# Altium schematic sheet [3] - POWER.SchDoc: POWER INPUT
size B; Organization: Altium Limited; Address1: L3, 12a Rodborough Rd; Address2: Frenchs Forest; Address3: NSW; Address4: Australia 2086; DocumentNumber: 3; Revision: V1I1; SheetNumber: 3; SheetTotal: 16
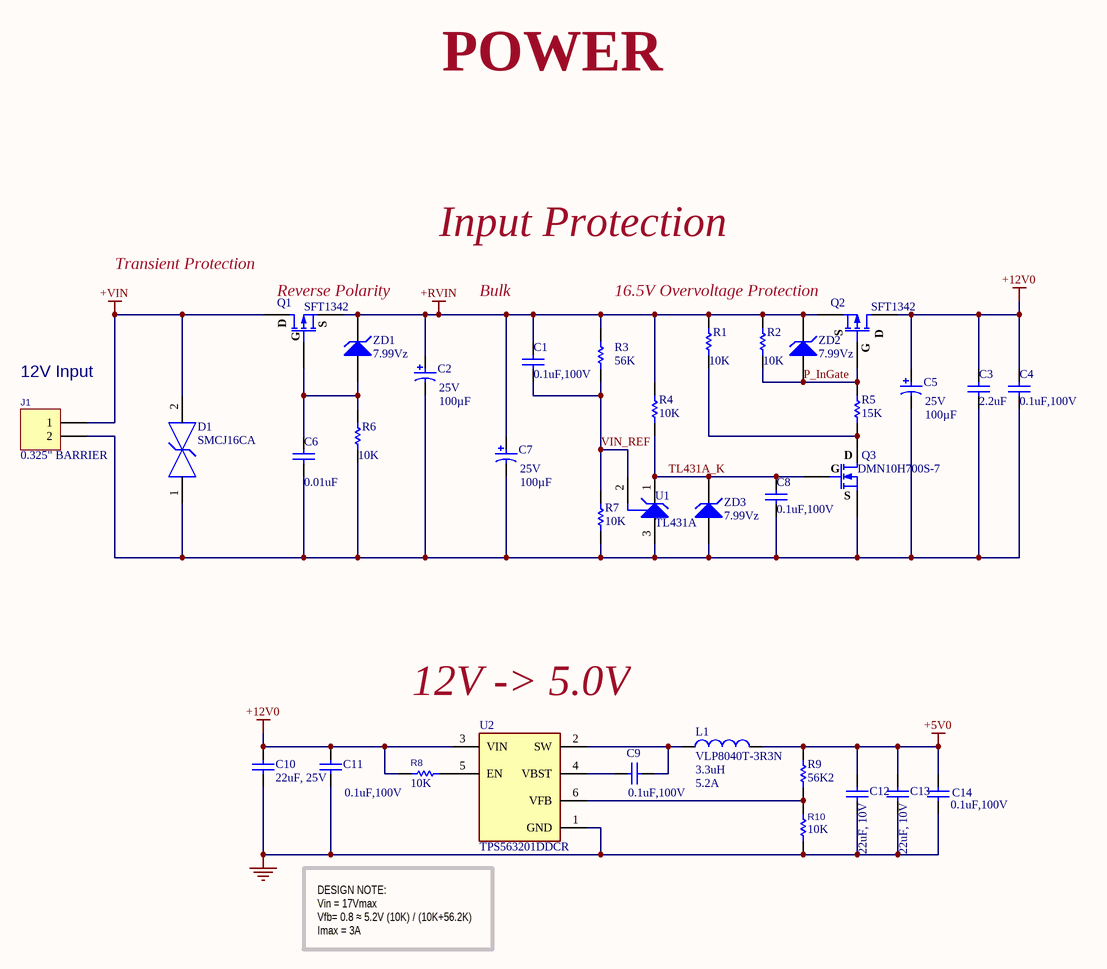
[diagram p0: [3] - POWER.SchDoc]

## Parts
C1  0.1uF,100V  [C0805]
C2  Capacitance: 100µF  Rated Voltage: 25V  [PNSC-FK-V-D8_V]  (hidden comment: EEEFK1E101XP)
C3  2.2uF  [C1206]
C4  0.1uF,100V  [C0805]
C5  Capacitance: 100µF  Rated Voltage: 25V  [PNSC-FK-V-D8_V]  (hidden comment: EEEFK1E101XP)
C6  0.01uF  [C0603]
C7  Capacitance: 100µF  Rated Voltage: 25V  [PNSC-FK-V-D8_V]  (hidden comment: EEEFK1E101XP)
C8  0.1uF,100V  [C0805]
C9  0.1uF,100V  [C0805]
C10  22uF, 25V  [C1210]
C11  0.1uF,100V  [C0805]
C12  22uF, 10V  [C0805]
C13  22uF, 10V  [C0805]
C14  0.1uF,100V  [C0805]
D1  SMCJ16CA  [FP-SMBJ-MFG]
J1  0.325" BARRIER  [Barrier2]
L1  VLP8040T-3R3N  Inductance: 3.3uH  RMS Current (Irms): 5.2A
Q1  SFT1342
Q2  SFT1342
Q3  DMN10H700S-7  [SOT90P240X110-3N]
R1  10K  [R0603]
R2  10K  [R0603]
R3  value 56K  [RESC1608X55X30ML15T15]  (hidden comment: ERJ3EKF5602V)
R4  10K  [R0603]
R5  15K  [R0603]
R6  10K  [R0603]
R7  10K  [R0603]
R8  10K  [R0402]
R9  56K2  [r0402]
R10  10K  [R0402]
U1  TL431A  [TL431AQDBZRQ1]
U2  TPS563201DDCR
ZD1  7.99Vz
ZD2  7.99Vz
ZD3  7.99Vz

## Nets
+5V0: C12.2 C13.2 C14.1 L1.2 R9.2
+12V0: C3.2 C4.2 C5.1 C10.2 C11.2 Q2.1(D) R8.1 U2.3(VIN)
+RVIN: C1.2 C2.1 C7.1 Q1.3(S) Q2.3(S) R1.2 R2.2 R3.2 R4.2 ZD1.2(K) ZD2.2(K)
+VIN: D1.2 J1.1 Q1.1(D)
GND: C10.1 C11.1 C12.1 C13.1 C14.2 R10.1 U2.1(GND)
P_InGate: Q2.2(G) R2.1 R5.2 ZD2.1(A)
TL431A_K: C8.2 Q3.1(G) R4.1 U1.1(CATHODE) ZD3.2(K)
VIN_REF: C1.1 R3.1 R7.2 U1.2(REF)
NetC2_2: C2.2 C3.1 C4.1 C5.2 C6.1 C7.2 C8.1 D1.1 J1.2 Q3.2(S) R6.1 R7.1 U1.3(ANODE) ZD3.1(A)
NetC6_2: C6.2 Q1.2(G) R6.2 ZD1.1(A)
NetC9_1: C9.1 L1.1 U2.2(SW)
NetC9_2: C9.2 U2.4(VBST)
NetQ3_3: Q3.3(D) R1.1 R5.1
NetR8_2: R8.2 U2.5(EN)
NetR9_1: R9.1 R10.2 U2.6(VFB)

## Notes on the sheet
- POWER
- (near Q1) Transient Protection
- Input Protection
- (near Q1) Reverse Polarity
- Bulk
- (near Q2) 16.5V Overvoltage Protection
- (near J1) 12V Input
- 12V -> 5.0V
- DESIGN NOTE:
  Vin = 17Vmax
  Vfb= 0.8 ≈ 5.2V (10K) / (10K+56.2K)
  Imax = 3A
- Title
- Size:
- Date:
- B
- Number:
- Time:
- Revision:
- Sheet
- of
- Mathew Locoteta
- 85 Artist Lake Dr.
- Middle Island
- New York, 11953
- United States of America
- File:

## Library data of the parts
C1 C4 C8 C9 C11 C14 = CL21B104KCFWPNE: CAP CER 0.1UF 100V X7R 0805; Manufacturer: Samsung; Capacitance: 100nF; Tolerance: 10%; Supplier 1: Digi-Key; Manufacturer Part Number: CL21B104KCFWPNE; Stock 1: 283289; Pricing 1: 1=0.16000, 10=0.11200, 100=0.05250, 500=0.03684, 1000=0.03050 (USD); RoHS: Yes; Mount: Surface Mount; Case/Package: 0805; Case Code (Metric): 2012; Case Code (Imperial): 0805; Min Operating Temperature: -55°C; Max Operating Temperature: 125°C; Packaging: Tape and Reel; Voltage Rating: 100V; Features: Soft Termination; Length: 0.079inch; Width: 0.049inch; Thickness: 0.053inch; Ratings: AEC-Q200; ComponentLink1URL: http://www.samsungsem.com/servlet/FileDownload?type=spec&file=CL21B104KCFWPNE.pdf&src-supplier=Avnet; ComponentLink1Description: http://www.samsungsem.com/servlet/FileDownload?type=spec&file=CL21B104KCFWPNE.pdf&src-supplier=Avnet; ComponentLink2URL: http://www.samsungsem.com/kr/support/product-search/mlcc/CL21B104KCFWPNE.jsp?src-supplier=Digi-Key; ComponentLink2Description: http://www.samsungsem.com/kr/support/product-search/mlcc/CL21B104KCFWPNE.jsp?src-supplier=Digi-Key; Supplier Part Number 1: 1276-6733-1-ND
C2 C5 C7 = CMP-2000-06206-1: Aluminum Electrolytic Capacitor, 100 uF, +/- 20%, 25 V, 2-Pin SMD (Size Code D8), -55 to 105 degC, RoHS, Tape and Reel; Manufacturer: Panasonic; Type: Can; Lifetime@Temperature: 2000Hrs@105°C; Ripple Current: 280mA; Impedance: 0.34O; Case Size/Dimension: Ø6.3x7.7mm; Operating Temp-Max: 105°C; Series: FK; Package URL: http://industrial.panasonic.com/cdbs/www-data/pdf/RDE0000/DME0000COL48.pdf; Mounting Technology: SurfaceMount; Package Description: 2-Pin Electrolytic Aluminum Capacitor, Body 6.6 x 6.6 mm; Datasheet Version: 03/2016; Datasheet URL: http://industrial.panasonic.com/cdbs/www-data/pdf/RDE0000/ABA0000C1181.pdf; Manufacturer URL: http://www.panasonic.com/; Package Reference: FK-V-D8; Operating Temp Range: -55to+105°C
C3 = C1206C225K5RECAUTO: CAP CER 1206 2.2UF 50V X7R 10%; Manufacturer: KEMET; Supplier 1: Digi-Key; Manufacturer Part Number: C1206C225K5RECAUTO; Stock 1: 3800; Pricing 1: 1=0.34000, 10=0.23200, 100=0.13130, 500=0.09268, 1000=0.08110 (USD); RoHS: No; ComponentLink1URL: https://api.kemet.com/component-edge/download/datasheet/C1206C225K5RECAUTO.pdf?src-supplier=Digi-Key; ComponentLink1Description: https://api.kemet.com/component-edge/download/datasheet/C1206C225K5RECAUTO.pdf?src-supplier=Digi-Key; Supplier Part Number 1: 399-17896-1-ND
C6 = C0603C103J5RACAUTO: Cap Ceramic 0.01uF 50V X7R 5% Pad SMD 0603 125C Automotive T/R; Manufacturer: KEMET; Capacitance: 10nF; Supplier 1: Digi-Key; Manufacturer Part Number: C0603C103J5RACAUTO; Stock 1: 20665; Pricing 1: 1=0.13000, 10=0.08900, 100=0.04200, 500=0.02946, 1000=0.02439 (USD); RoHS: Yes; Mount: Surface Mount; Case/Package: 0603; Case Code (Metric): 1608; Case Code (Imperial): 0603; Dielectric Material: Ceramic; Min Operating Temperature: -55°C; Max Operating Temperature: 125°C; Packaging: Tape and Reel; Voltage Rating: 50V; Tolerance: 5%; Voltage Rating (DC): 50V; Dielectric: X7R; Length: 0.063inch; Width: 0.031inch; Thickness: 0.034inch; Ratings: AEC-Q200; ComponentLink1URL: http://www.farnell.com/datasheets/2626787.pdf?src-supplier=Farnell; ComponentLink1Description: http://www.farnell.com/datasheets/2626787.pdf?src-supplier=Farnell; ComponentLink2URL: http://www.farnell.com/datasheets/2749442.pdf?src-supplier=Farnell; ComponentLink2Description: http://www.farnell.com/datasheets/2749442.pdf?src-supplier=Farnell; ComponentLink3URL: https://api.kemet.com/component-edge/download/datasheet/C0603C103J5RACAUTO.pdf?src-supplier=Digi-Key; ComponentLink3Description: https://api.kemet.com/component-edge/download/datasheet/C0603C103J5RACAUTO.pdf?src-supplier=Digi-Key; Supplier Part Number 1: 399-12983-1-ND
C10 = TMK325B7226MMHP: 22µF ±20% 25V Ceramic Capacitor X7R 1210 (3225 Metric) /; Manufacturer: Taiyo Yuden; Supplier 1: Digi-Key; Manufacturer Part Number: TMK325B7226MMHP; RoHS: No; Stock 1: 1378; Pricing 1: 1=0.84000, 10=0.64100, 100=0.45870, 500=0.35514 (USD); Supplier Part Number 1: 587-TMK325B7226MMHPCT-ND
C12 C13 = GRM21BR61A226ME51L: MURATA - GRM21BR61A226ME51L - CAP, MLCC, X5R, 22UF, 10V, 0805; Tolerance: 20%; Supplier 1: Digi-Key; Manufacturer: Murata; Manufacturer Part Number: GRM21BR61A226ME51L; RoHS: Yes; Category: Ceramic Capacitors; Stock 1: 2854415; Pricing 1: 1=0.36000, 10=0.24400, 100=0.13810, 500=0.09746, 1000=0.08529 (USD); Mount: Surface Mount; Case/Package: 0805; Weight: 0.000335oz; Case Code (Imperial): 0805; Case Code (Metric): 2012; Min Operating Temperature: -55°C; Max Operating Temperature: 85°C; Dielectric: X5R; Termination: SMD/SMT; Voltage Rating (DC): 10V; Package Quantity: 3000; Capacitance: 22uF; Packaging: Tape and Reel; Voltage Rating: 10V; Length: 2mm; Height: 1.25mm; Width: 0.049inch; Thickness: 0.055inch; Depth: 1.25mm; Radiation Hardening: No; Lead Free: Lead Free; REACH SVHC: No SVHC; ComponentLink1URL: http://www.farnell.com/datasheets/1955716.pdf?src-supplier=Farnell; ComponentLink1Description: http://www.farnell.com/datasheets/1955716.pdf?src-supplier=Farnell; ComponentLink2URL: http://components.arrow.com/part/dataview/0323_06961245?src-supplier=Arrow+Europe; ComponentLink2Description: http://components.arrow.com/part/dataview/0323_06961245?src-supplier=Arrow+Europe; ComponentLink3URL: http://www.mouser.com/ds/2/281/c02e-2905.pdf?src-supplier=Mouser; ComponentLink3Description: http://www.mouser.com/ds/2/281/c02e-2905.pdf?src-supplier=Mouser; ComponentLink4URL: http://psearch.en.murata.com/capacitor/product/GRM21BR61A226ME51%23.html?src-supplier=Avnet; ComponentLink4Description: http://psearch.en.murata.com/capacitor/product/GRM21BR61A226ME51%23.html?src-supplier=Avnet; ComponentLink5URL: http://www.farnell.com/datasheets/1955716.pdf?src-supplier=Element14; ComponentLink5Description: http://www.farnell.com/datasheets/1955716.pdf?src-supplier=Element14; ComponentLink6URL: http://search.murata.co.jp/Ceramy/image/img/A01X/G101/ENG/GRM21BR61A226ME51-01.pdf?src-supplier=Digi-Key; ComponentLink6Description: http://search.murata.co.jp/Ceramy/image/img/A01X/G101/ENG/GRM21BR61A226ME51-01.pdf?src-supplier=Digi-Key; ComponentLink7URL: http://www.farnell.com/datasheets/1955716.pdf?src-supplier=Newark; ComponentLink7Description: http://www.farnell.com/datasheets/1955716.pdf?src-supplier=Newark; Supplier Part Number 1: 490-10511-6-ND
D1 = CMP-08607-000021-1: TVS DIODE 18V 29.2V DO214AA; Manufacturer Part Number: SMCJ18CA; Manufacturer: Littelfuse Inc; Number Of Channels: 1; Peak Pulse Power: 600W; Max Junction Temp: +150°C; Peak Pulse Current: 20.6A; Direction: Bidirectional; Breakdown Voltage: 20V; RoHS: TRUE; Lead Free: Yes; Category: Diode; Clamping Voltage: 29.2V; Height: 2.61mm; Reverse Standoff Voltage: 18V; Device Class L3: unset; Device Class L2: TVS Diodes; Package: SMBJ; Digikey Description: TVS DIODE 18V 29.2V DO214AA; Device Class L1: Circuit Protection; ComponentLink2Description: Datasheet; ComponentLink2URL: https://www.littelfuse.com/~/media/electronics/datasheets/tvs_diodes/littelfuse_tvs_diode_smbj_datasheet.pdf.pdf; Temperature: -65°C to +150°C; Temperature Range High: +150°C; Mouser Description: SMBJ Series 29.2 V 0.6 kW Surface Mount Bi-Directional TVS Diode - DO-214AA; Automotive: No; Octopart: https://octopart.com/smbj18ca-littelfuse-350695; Temperature Range Low: -65°C
J1 = OSTYK42102030: CONN BARRIER STRIP 2CIRC 0.325"; Manufacturer: On-Shore Technology; Current Rating: 20A; Voltage Rating: 300V; Number of Circuits: 2; Wire Gauge (Max): 22AWG; Wire Gauge (Min): 12AWG; Pitch: 0.325inch; Supplier 1: Digi-Key; Manufacturer Part Number: OSTYK42102030; Stock 1: 3686; Pricing 1: 1=0.83000, 10=0.51800, 25=0.44320, 50=0.39840, 100=0.39010, 250=0.33200, 500=0.31540, 1000=0.28220, 5000=0.22078 (USD); RoHS: Yes; Mount: Through Hole; Color: Black; Insulation Material: Nylon; Min Operating Temperature: -40°C; Max Operating Temperature: 105°C; Number of Rows: 1; Packaging: Bulk; Number of Wire Entries: 2; Flammability Rating: UL94 V-0; ComponentLink1URL: https://datasheet.ciiva.com/778/ostyk421xx030-778467.pdf?src-supplier=Digi-Key; ComponentLink1Description: https://datasheet.ciiva.com/778/ostyk421xx030-778467.pdf?src-supplier=Digi-Key; Supplier Part Number 1: ED2945-ND
L1 = VLP8040T-3R3N: FIXED IND 3.3UH 5.2A 20 MOHM SMD; Manufacturer: TDK; Core Material: Ferrite; DC Resistance (DCR): 20mR; Test Frequency: 100kHz; Tolerance: 30%; Shielding: Shielded; Supplier 1: Digi-Key; Manufacturer Part Number: VLP8040T-3R3N; RoHS: Yes; Category: Fixed Inductors; Stock 1: 95; Pricing 1: 1=0.60000, 10=0.52700 (USD); Mount: Surface Mount; Case/Package: Nonstandard; Min Operating Temperature: -40°C; Max Operating Temperature: 105°C; Max DC Current: 5.2A; Termination: SMD/SMT; Composition: Wirewound; Military Standard: Not; Package Quantity: 1; Packaging: Tape and Reel; Inductance Tolerance: 30%; Current Rating: 5.2A; Saturation Current: 5.2A; Length: 0.315inch; Height: 4mm; Height - Seated (Max): 0.157inch; Depth: 8.7mm; Width: 8mm; Lead Free: Lead Free; REACH SVHC: No SVHC; ComponentLink1URL: https://datasheet.ciiva.com/4963/e531-vlp-7911-4963552.pdf?src-supplier=Mouser; ComponentLink1Description: https://datasheet.ciiva.com/4963/e531-vlp-7911-4963552.pdf?src-supplier=Mouser; Supplier Part Number 1: 445-6581-1-ND
Q1 Q2 = SFT1342-TL-W: MOSFET P-CH 60V 12A TP-FA; Manufacturer: ON Semiconductor; Rds On Max: 62mR; Input Capacitance: 1.15nF; Max Power Dissipation: 1W; Turn-On Delay Time: 10ns; Rise Time: 37ns; Turn-Off Delay Time: 135ns; Fall Time: 75ns; Gate to Source Voltage (Vgs): 20V; Number of Channels: 1; Drain to Source Breakdown Voltage: -60V; Drain to Source Resistance: 47mR; Reverse Standoff Voltage: 48V; Min Breakdown Voltage: 53.3V; Clamping Voltage: 76V; Power Line Protection: No; Peak Pulse Current: 48A; Supplier 1: Digi-Key; Manufacturer Part Number: SFT1342-TL-W; Stock 1: 758; Pricing 1: 1=0.92000, 10=0.82100, 100=0.64030 (USD); RoHS: Yes; Mount: Surface Mount; Case/Package: TO-252-3; Number of Pins: 4; Weight: 0.139332oz; Min Operating Temperature: -55°C; Max Operating Temperature: 150°C; Package Quantity: 700; Packaging: Tape and Reel; Drain to Source Voltage (Vdss): 60V; Continuous Drain Current (ID): 12A; Length: 7mm; Height: 2.3mm; Width: 6.5mm; Lead Free: Lead Free; ComponentLink1URL: https://datasheet.ciiva.com/46629/sft1342-d-46629559.pdf?src-supplier=Digi-Key; ComponentLink1Description: https://datasheet.ciiva.com/46629/sft1342-d-46629559.pdf?src-supplier=Digi-Key; Supplier Part Number 1: SFT1342-TL-WOSCT-ND; Number of Unidirectional Channels: 1; Composition: Zener; ComponentLink2URL: http://www.mouser.com/ds/2/389/ldp01-26ay-954974.pdf?src-supplier=Mouser; ComponentLink2Description: http://www.mouser.com/ds/2/389/ldp01-26ay-954974.pdf?src-supplier=Mouser; ComponentLink3URL: http://www.st.com/content/ccc/resource/technical/document/datasheet/67/34/b5/f8/23/2c/46/6e/DM00122355.pdf/files/DM00122355.pdf/jcr:content/translations/en.DM00122355.pdf?src-supplier=Digi-Key; ComponentLink3Description: http://www.st.com/content/ccc/resource/technical/document/datasheet/67/34/b5/f8/23/2c/46/6e/DM00122355.pdf/files/DM00122355.pdf/jcr:content/translations/en.DM00122355.pdf?src-supplier=Digi-Key
Q3 = DMN10H700S-7: MOSFET N-CHA 100V 700MA SOT23; Manufacturer: Diodes; Rds On Max: 700mR; Input Capacitance: 235pF; Max Power Dissipation: 400mW; Supplier 1: Digi-Key; Manufacturer Part Number: DMN10H700S-7; Stock 1: 12863; Pricing 1: 1=0.41000, 10=0.30800, 100=0.17450, 500=0.11556, 1000=0.08860 (USD); RoHS: Yes; Mount: Surface Mount; Case/Package: TO-236-3; Min Operating Temperature: -55°C; Max Operating Temperature: 150°C; Packaging: Tape and Reel; Drain to Source Voltage (Vdss): 100V; Continuous Drain Current (ID): 700mA; ComponentLink1URL: https://www.diodes.com/assets/Datasheets/DMN10H700S.pdf?src-supplier=Digi-Key; ComponentLink1Description: https://www.diodes.com/assets/Datasheets/DMN10H700S.pdf?src-supplier=Digi-Key; Supplier Part Number 1: DMN10H700S-7DICT-ND
R1 R2 R4 R6 R7 = RMCF0603FT10K0: RES 10K OHM 1% 1/10W 0603; Manufacturer: Stackpole Electronics; Resistance: 10kR; Power Rating: 100mW; Temperature Coefficient: 100ppm/°C; Supplier 1: Digi-Key; Manufacturer Part Number: RMCF0603FT10K0; Stock 1: 2968232; Pricing 1: 1=0.10000, 10=0.01700, 100=0.00680, 1000=0.00306, 2500=0.00266 (USD); RoHS: Yes; Mount: Surface Mount; Case/Package: 0603; Case Code (Metric): 1608; Case Code (Imperial): 0603; Contact Plating: Tin,Matte; Min Operating Temperature: -55°C; Max Operating Temperature: 155°C; Tolerance: 1%; Packaging: Tape and Reel; Composition: Thick Film; Number of Terminations: 2; Military Standard: Not; Max Power Dissipation: 100mW; Features: Automotive AEC-Q200; Length: 1.55mm; Height: 0.022inch; Width: 0.031inch; Depth: 0.8mm; Radiation Hardening: No; Lead Free: Lead Free; ComponentLink1URL: http://components.arrow.com/part/dataview/43747082S6756917N1174?src-supplier=Arrow; ComponentLink1Description: http://components.arrow.com/part/dataview/43747082S6756917N1174?src-supplier=Arrow; ComponentLink2URL: https://www.seielect.com/catalog/sei-rmcf_rmcp.pdf?src-supplier=Digi-Key; ComponentLink2Description: https://www.seielect.com/catalog/sei-rmcf_rmcp.pdf?src-supplier=Digi-Key; ComponentLink3URL: https://www.seielect.com/catalog/SEI-RMCF_RMCP.pdf?src-supplier=Avnet; ComponentLink3Description: https://www.seielect.com/catalog/SEI-RMCF_RMCP.pdf?src-supplier=Avnet; ComponentLink4URL: http://www.seielect.com/catalog/sei-rmc.pdf?src-supplier=Future+Electronics; ComponentLink4Description: http://www.seielect.com/catalog/sei-rmc.pdf?src-supplier=Future+Electronics; ComponentLink5URL: https://www.verical.com/server-webapp/html/getDatasheet?partID=360913&src-supplier=Verical; ComponentLink5Description: https://www.verical.com/server-webapp/html/getDatasheet?partID=360913&src-supplier=Verical; Supplier Part Number 1: RMCF0603FT10K0CT-ND
R3 = CMP-2000-00566-1: Manufacturer: Panasonic; Part Number: ERJ3EKF5602V
R5 = RMCF0603FT15K0: RES 15K OHM 1% 1/10W 0603; Manufacturer: Stackpole Electronics; Resistance: 15kR; Power Rating: 100mW; Temperature Coefficient: 100ppm/°C; Supplier 1: Digi-Key; Manufacturer Part Number: RMCF0603FT15K0; Stock 1: 34649; Pricing 1: 1=0.10000, 10=0.01700, 100=0.00680, 1000=0.00306, 2500=0.00266 (USD); RoHS: Yes; Mount: Surface Mount; Case/Package: 0603; Case Code (Metric): 1608; Case Code (Imperial): 0603; Contact Plating: Tin,Matte; Min Operating Temperature: -55°C; Max Operating Temperature: 155°C; Tolerance: 1%; Packaging: Tape and Reel; Composition: Thick Film; Number of Terminations: 2; Military Standard: Not; Max Power Dissipation: 100mW; Features: Automotive AEC-Q200; Length: 0.061inch; Height: 0.022inch; Width: 0.031inch; Depth: 0.8mm; Radiation Hardening: No; Lead Free: Lead Free; ComponentLink1URL: https://datasheet.ciiva.com/15193/getdatasheetpartid-372144-15193446.pdf?src-supplier=Verical; ComponentLink1Description: https://datasheet.ciiva.com/15193/getdatasheetpartid-372144-15193446.pdf?src-supplier=Verical; Supplier Part Number 1: RMCF0603FT15K0CT-ND
R8 R10 = RMCF0402FT10K0: RES 10K OHM 1% 1/16W 0402; Manufacturer: Stackpole Electronics; Resistance: 10kR; Power Rating: 62.5mW; Temperature Coefficient: 100ppm/°C; Max Power Dissipation: 63mW; Supplier 1: Digi-Key; Manufacturer Part Number: RMCF0402FT10K0; Stock 1: 6276240; Pricing 1: 1=0.10000, 10=0.01500, 100=0.00610, 1000=0.00275, 2500=0.00239, 5000=0.00198 (USD); RoHS: Yes; Mount: Surface Mount; Case/Package: 0402; Case Code (Metric): 1005; Case Code (Imperial): 0402; Contact Plating: Tin,Matte; Min Operating Temperature: -55°C; Max Operating Temperature: 155°C; Tolerance: 1%; Packaging: Tape and Reel; Composition: Thick Film; Number of Terminations: 2; Military Standard: Not; Features: Automotive AEC-Q200; Length: 1mm; Height: 0.016inch; Width: 0.02inch; Depth: 0.5mm; Radiation Hardening: No; Lead Free: Lead Free; ComponentLink1URL: https://datasheet.ciiva.com/24341/sei-rmcp-24341800.pdf?src-supplier=Onlinecomponents.com; ComponentLink1Description: https://datasheet.ciiva.com/24341/sei-rmcp-24341800.pdf?src-supplier=Onlinecomponents.com; Supplier Part Number 1: RMCF0402FT10K0DKR-ND
R9 = RMCF0402FT56K2: Res Thick Film 0402 56.2K Ohm 1% 0.063W ±100ppm/°C Molded SMD Paper T/R; Manufacturer: Stackpole Electronics; Max Power Dissipation: 63mW; Resistance: 56.2kR; Supplier 1: Digi-Key; Manufacturer Part Number: RMCF0402FT56K2; RoHS: Yes; Category: Chip SMD Resistors; Stock 1: 13255; Pricing 1: 1=0.10000, 10=0.01400, 100=0.00580, 1000=0.00262, 2500=0.00228, 5000=0.00188 (USD); Mount: Surface Mount; Case/Package: 0402; Contact Plating: Tin,Matte; Case Code (Metric): 1005; Case Code (Imperial): 0402; Min Operating Temperature: -55°C; Max Operating Temperature: 155°C; Temperature Coefficient: 100ppm/°C; Tolerance: 1%; Packaging: Tape and Reel; Features: Automotive AEC-Q200; Composition: Thick Film; Number of Terminations: 2; Length: 0.039inch; Height: 0.016inch; Width: 0.02inch; Lead Free: Lead Free; ComponentLink1URL: https://www.seielect.com/Catalog/SEI-RMCF_RMCP.pdf?src-supplier=Digi-Key; ComponentLink1Description: https://www.seielect.com/Catalog/SEI-RMCF_RMCP.pdf?src-supplier=Digi-Key; ComponentLink2URL: https://www.seielect.com/catalog/SEI-Packaging.pdf?src-supplier=Digi-Key; ComponentLink2Description: https://www.seielect.com/catalog/SEI-Packaging.pdf?src-supplier=Digi-Key; ComponentLink3URL: https://www.seielect.com/Catalog/SEI-RMCF_RMCP.pdf?src-supplier=Avnet; ComponentLink3Description: https://www.seielect.com/Catalog/SEI-RMCF_RMCP.pdf?src-supplier=Avnet; Supplier Part Number 1: RMCF0402FT56K2CT-ND
U1 = TL431AQDBZRQ1: IC VREF SHUNT ADJ SOT23-3; Manufacturer: Texas Instruments; Tolerance: 1%; Number of Channels: 1; Output Voltage: 36V; Max Input Voltage: 37V; Max Output Current: 100mA; Temperature Coefficient: 34ppm/°C; Cathode Current: 700uA; Reference Type: Shunt,Adjustable; Supplier 1: Digi-Key; Manufacturer Part Number: TL431AQDBZRQ1; Stock 1: 108372; Pricing 1: 1=0.43000, 10=0.36700, 100=0.27400, 500=0.21528, 1000=0.16635 (USD); RoHS: Yes; Case/Package: SOT-23-3; Number of Pins: 3; Min Operating Temperature: -40°C; Max Operating Temperature: 125°C; Package Quantity: 1; Packaging: Tape and Reel; Output Current: 100mA; Max Output Voltage: 36V; Reference Voltage: 36V; Radiation Hardening: No; REACH SVHC: No SVHC; Lead Free: Lead Free; ComponentLink1URL: https://datasheet.ciiva.com/2006/tl431a-q1-2006256.pdf?src-supplier=Digi-Key; ComponentLink1Description: https://datasheet.ciiva.com/2006/tl431a-q1-2006256.pdf?src-supplier=Digi-Key; ComponentLink2URL: https://datasheet.ciiva.com/3235/tl431b-q1-3235610.pdf?src-supplier=Avnet; ComponentLink2Description: https://datasheet.ciiva.com/3235/tl431b-q1-3235610.pdf?src-supplier=Avnet; ComponentLink3URL: https://datasheet.ciiva.com/3235/tl431b-q1-3235611.pdf?src-supplier=Avnet; ComponentLink3Description: https://datasheet.ciiva.com/3235/tl431b-q1-3235611.pdf?src-supplier=Avnet; ComponentLink4URL: https://datasheet.ciiva.com/26222/tl431b-q1-26222111.pdf?src-supplier=Avnet+Europe; ComponentLink4Description: https://datasheet.ciiva.com/26222/tl431b-q1-26222111.pdf?src-supplier=Avnet+Europe; Supplier Part Number 1: 296-21853-1-ND
U2 = TPS563201DDCR: IC REG BUCK ADJ 3A TSOT23-6; Manufacturer: Texas Instruments; Number of Outputs: 1; Min Input Voltage: 4.5V; Max Input Voltage: 17V; Min Output Voltage: 768mV; Max Output Voltage: 7V; Switching Frequency: 580kHz; Synchronous Rectifier: Yes; Quiescent Current: 400uA; Output Type: Adjustable; Output Configuration: Positive; Supplier 1: Digi-Key; Manufacturer Part Number: TPS563201DDCR; RoHS: Yes; Category: Power Supply Modules; Stock 1: 4338; Pricing 1: 1=0.92000, 10=0.81200, 25=0.76280, 100=0.57810, 250=0.49200, 500=0.46740, 1000=0.35670 (USD); Mount: Surface Mount; Case/Package: SOT-23-6; Number of Pins: 6; Min Operating Temperature: -40°C; Max Operating Temperature: 125°C; Packaging: Tape and Reel; Output Current: 3A; Lead Free: Lead Free; ComponentLink1URL: http://www.ti.com/lit/ds/symlink/tps563201.pdf?src-supplier=Digi-Key; ComponentLink1Description: http://www.ti.com/lit/ds/symlink/tps563201.pdf?src-supplier=Digi-Key; ComponentLink2URL: http://www.ti.com/general/docs/suppproductinfo.tsp?distId=10&amp;gotoUrl=http%3A%2F%2Fwww.ti.com%2Flit%2Fgpn%2Ftps563201&src-supplier=Digi-Key; ComponentLink2Description: http://www.ti.com/general/docs/suppproductinfo.tsp?distId=10&amp;gotoUrl=http%3A%2F%2Fwww.ti.com%2Flit%2Fgpn%2Ftps563201&src-supplier=Digi-Key; ComponentLink3URL: http://www.ti.com/lit/gpn/tps563201?src-supplier=Mouser; ComponentLink3Description: http://www.ti.com/lit/gpn/tps563201?src-supplier=Mouser; Supplier Part Number 1: 296-47238-1-ND
ZD1-ZD3 = PLZ8V2B-G3/H: Zener Diode Microsmf Do-219Ac; Manufacturer: Vishay; Supplier 1: Digi-Key; Manufacturer Part Number: PLZ8V2B-G3/H; Stock 1: 22500; Pricing 1: 1=0.28000, 10=0.23300, 25=0.19480, 100=0.12330, 250=0.09516, 500=0.08112, 1000=0.05516 (USD); Supplier Part Number 1: PLZ8V2B-G3/HGICT-ND